# EAGLE design tracer-main (EAGLE 9.6.2)
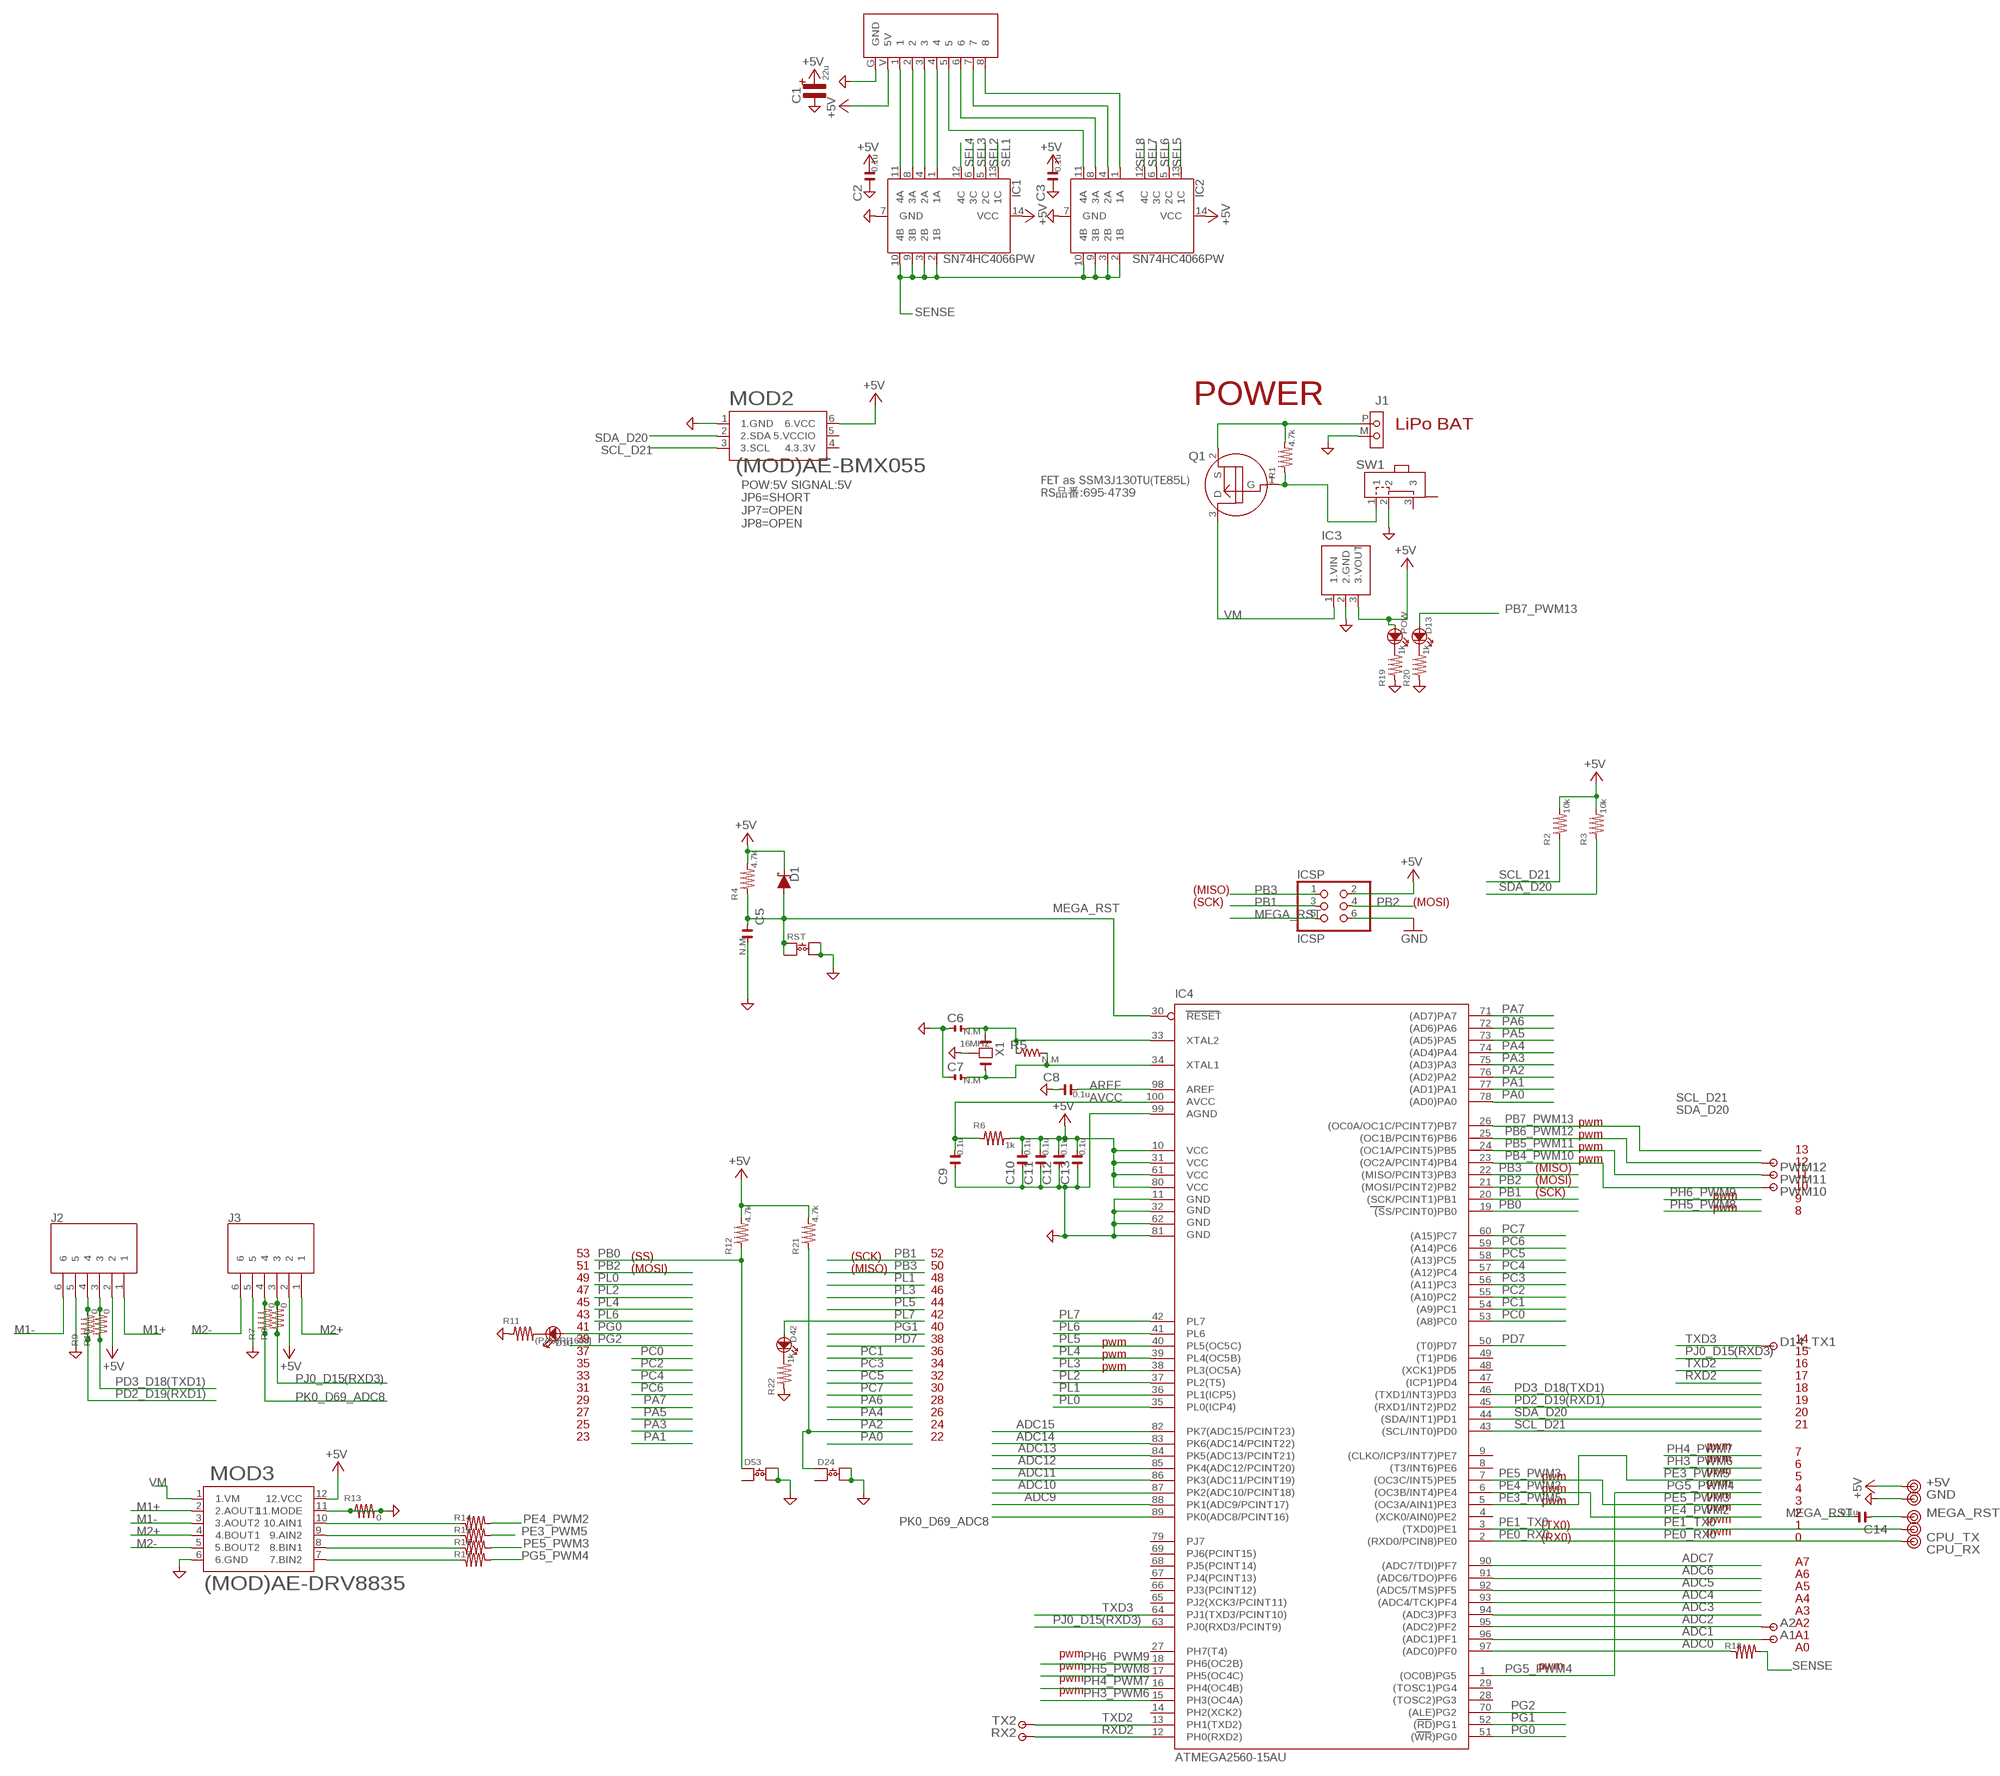
[diagram p0: schematic, sheet 1]

## Parts
+5V  TP-HOLE  [TP-HOLE]
A1  TP  [TP-SQUARE]
A2  TP  [TP-SQUARE]
C1  22u  (PAS)C[3216]  [3216]
C2  0.1u  (PAS)C[1608]  [1608NEW]
C3  0.1u  (PAS)C[1608]  [1608NEW]
C5  N.M  (PAS)C[1608]  [1608NEW]
C6  N.M  C(1005)  [1005]
C7  N.M  C(1005)  [1005]
C8  0.1u  (PAS)C[1608]  [1608NEW]
C9  0.1u  (PAS)C[1608]  [1608NEW]
C10  0.1u  (PAS)C[1608]  [1608NEW]
C11  0.1u  (PAS)C[1608]  [1608NEW]
C12  0.1u  (PAS)C[1608]  [1608NEW]
C13  0.1u  (PAS)C[1608]  [1608NEW]
C14  0.1u  (PAS)C[1608]  [1608NEW]
CPU_RX  TP-HOLE  [TP-HOLE]
CPU_TX  TP-HOLE  [TP-HOLE]
D1  1A/23V/620mV  DIODE-SCHOTTKY-BAT20J  [SOD-323]
D10  (PAS)LED[1608]  [1608LED]
D13  (PAS)LED[1608]  [1608LED]
D14_TX1  TP  [TP-SQUARE]
D24  (SW)USER_SW(AKIDUKI)  [SKRPACE010-PAC]
D42  (PAS)LED[1608]  [1608LED]
D53  (SW)USER_SW(AKIDUKI)  [SKRPACE010-PAC]
GND  TP-HOLE  [TP-HOLE]
IC1  SN74HC4066PW  [SOP65P640X120-14N]
IC2  SN74HC4066PW  [SOP65P640X120-14N]
IC3  (3.3V)VX07803-500  [VX07803-PAC]
IC4  ATMEGA2560-15AU  0023_ATMEGA2560-16AU  [TQFP100]
ICSP  ICSP  0114_PH254-203DF118A00V  [2X03]
J1  B2B-PH  [B2B-PH-PAC]
J2  B6B-ZR-3.4_LF__SN_  [B6BZR34LFSN]
J3  B6B-ZR-3.4_LF__SN_  [B6BZR34LFSN]
MEGA_RST  TP-HOLE  [TP-HOLE]
MOD1  (MOD)LINE-TRACER  [8CH-LINETRACER-MOD]
MOD2  (MOD)AE-BMX055  [MOD-BMX055]
MOD3  (MOD)AE-DRV8835  [AE-DRV8835]
POW  (PAS)LED[1608]  [1608LED]
PWM10  TP  [TP-SQUARE]
PWM11  TP  [TP-SQUARE]
PWM12  TP  [TP-SQUARE]
Q1  FET-PCH(SSM3J130TU)  [SOT65P210X75-3N]
R1  4.7k  (PAS)R[1608]  [1608NEW]
R2  10k  (PAS)R[1608]  [1608NEW]
R3  10k  (PAS)R[1608]  [1608NEW]
R4  4.7k  (PAS)R[1608]  [1608NEW]
R5  N.M  R(1005)  [1005]
R6  1k  (PAS)R[1608]  [1608NEW]
R7  0  (PAS)R[1608]  [1608NEW]
R8  0  (PAS)R[1608]  [1608NEW]
R9  0  (PAS)R[1608]  [1608NEW]
R10  0  (PAS)R[1608]  [1608NEW]
R11  (PAS)R[1608]  [1608NEW]
R12  4.7k  (PAS)R[1608]  [1608NEW]
R13  0  (PAS)R[1608]  [1608NEW]
R14  30  (PAS)R[1608]  [1608NEW]
R15  30  (PAS)R[1608]  [1608NEW]
R16  30  (PAS)R[1608]  [1608NEW]
R17  30  (PAS)R[1608]  [1608NEW]
R18  30  (PAS)R[1608]  [1608NEW]
R19  1k  (PAS)R[1608]  [1608NEW]
R20  1k  (PAS)R[1608]  [1608NEW]
R21  4.7k  (PAS)R[1608]  [1608NEW]
R22  1k  (PAS)R[1608]  [1608NEW]
RST  (SW)USER_SW(AKIDUKI)  [SKRPACE010-PAC]
RX2  TP  [TP-SQUARE]
SW1  MSK12C01  [MSK12C01]
TX2  TP  [TP-SQUARE]
X1  16MHZ  (RESONATOR)CSTCE_10_12_16_20MHZ  [AWSCR8]

## Nets
+5V: +5V.1 C1.1(P) C2.2 C3.2 C10.2 C11.2 C12.2 C13.2 D1.C IC1.14(VCC) IC2.14(VCC) IC3.3(3.VOUT) IC4.10(VCC) IC4.31(VCC1) IC4.61(VCC2) IC4.80(VCC3) ICSP.2 J2.2 J3.2 MOD1.V(5V) MOD2.6(6.VCC) MOD3.12(12.VCC) POW.1(+) R2.2 R3.2 R4.2 R6.2 R12.2 R21.2
ADC0: IC4.97((ADC0)PF0) R18.1
ADC1: A1.1 IC4.96((ADC1)PF1)
ADC2: A2.1 IC4.95((ADC2)PF2)
ADC3: IC4.94((ADC3)PF3)
ADC4: IC4.93((ADC4/TCK)PF4)
ADC5: IC4.92((ADC5/TMS)PF5)
ADC6: IC4.91((ADC6/TDO)PF6)
ADC7: IC4.90((ADC7/TDI)PF7)
ADC9: IC4.88(PK1(ADC9/PCINT17))
ADC10: IC4.87(PK2(ADC10/PCINT18))
ADC11: IC4.86(PK3(ADC11/PCINT19))
ADC12: IC4.85(PK4(ADC12/PCINT20))
ADC13: IC4.84(PK5(ADC13/PCINT21))
ADC14: IC4.83(PK6(ADC14/PCINT22))
ADC15: IC4.82(PK7(ADC15/PCINT23))
AREF: C8.2 IC4.98(AREF)
AVCC: C9.2 IC4.100(AVCC) R6.1
GND: C1.2(M) C2.1 C3.1 C5.2 C6.1 C7.1 C8.1 C9.1 C10.1 C11.1 C12.1 C13.1 D24.2 D24.4 D53.2 D53.4 GND.1 IC1.7(GND) IC2.7(GND) IC3.2(2.GND) IC4.11(GND) IC4.32(GND1) IC4.62(GND2) IC4.81(GND3) IC4.99(AGND) ICSP.6 J1.M J2.5 J3.5 MOD1.G(GND) MOD2.1(1.GND) MOD3.6(6.GND) MOD3.11(11.MODE) R11.1 R13.1 R13.2 R19.1 R20.1 R22.1 RST.2 RST.4 SW1.2 X1.2
M1+: J2.1 MOD3.2(2.AOUT1)
M1-: J2.6 MOD3.3(3.AOUT2)
M2+: J3.1 MOD3.4(4.BOUT1)
M2-: J3.6 MOD3.5(5.BOUT2)
MEGA_RST: C5.1 C14.2 D1.A IC4.30(RESET) ICSP.5 R4.1 RST.1 RST.3
N$1: IC1.11(4A) MOD1.1
N$2: IC1.8(3A) MOD1.2
N$3: IC1.4(2A) MOD1.3
N$4: IC1.1(1A) MOD1.4
N$5: IC2.11(4A) MOD1.5
N$6: IC2.8(3A) MOD1.6
N$7: IC2.4(2A) MOD1.7
N$8: IC2.1(1A) MOD1.8
N$9: J1.P Q1.2(S) R1.2
N$10: Q1.1(G) R1.1 SW1.1
N$11: C14.1 MEGA_RST.1
N$12: MOD3.10(10.AIN1) R14.1
N$13: C6.2 IC4.33(XTAL2) R5.1 X1.1
N$14: C7.2 IC4.34(XTAL1) R5.2 X1.3
N$15: MOD3.9(9.AIN2) R15.1
N$16: MOD3.8(8.BIN1) R16.1
N$17: MOD3.7(7.BIN2) R17.1
N$18: POW.2(-) R19.2
N$19: D13.2(-) R20.2
N$20: D42.2(-) R22.2
N$24: D10.2(-) R11.2
PA0: IC4.78((AD0)PA0)
PA1: IC4.77((AD1)PA1)
PA2: D24.1 IC4.76((AD2)PA2) R21.1
PA3: IC4.75((AD3)PA3)
PA4: IC4.74((AD4)PA4)
PA5: IC4.73((AD5)PA5)
PA6: IC4.72((AD6)PA6)
PA7: IC4.71((AD7)PA7)
PB0: D53.1 IC4.19((SS/PCINT0)PB0) R12.1
PB1: IC4.20((SCK/PCINT1)PB1) ICSP.3
PB2: IC4.21((MOSI/PCINT2)PB2) ICSP.4
PB3: IC4.22((MISO/PCINT3)PB3) ICSP.1
PB4_PWM10: IC4.23((OC2A/PCINT4)PB4) PWM10.1
PB5_PWM11: IC4.24((OC1A/PCINT5)PB5) PWM11.1
PB6_PWM12: IC4.25((OC1B/PCINT6)PB6) PWM12.1
PB7_PWM13: D13.1(+) IC4.26((OC0A/OC1C/PCINT7)PB7)
PC0: IC4.53((A8)PC0)
PC1: IC4.54((A9)PC1)
PC2: IC4.55((A10)PC2)
PC3: IC4.56((A11)PC3)
PC4: IC4.57((A12)PC4)
PC5: IC4.58((A13)PC5)
PC6: IC4.59((A14)PC6)
PC7: IC4.60((A15)PC7)
PD2_D19(RXD1): IC4.45((RXD1/INT2)PD2) J2.4 R9.1 R9.2
PD3_D18(TXD1): IC4.46((TXD1/INT3)PD3) J2.3 R10.1 R10.2
PD7: IC4.50((T0)PD7)
PE0_RX0: CPU_RX.1 IC4.2((RXD0/PCIN8)PE0)
PE1_TX0: CPU_TX.1 IC4.3((TXD0)PE1)
PE3_PWM5: IC4.5((OC3A/AIN1)PE3) R15.2
PE4_PWM2: IC4.6((OC3B/INT4)PE4) R14.2
PE5_PWM3: IC4.7((OC3C/INT5)PE5) R16.2
PG0: D10.1(+) IC4.51((WR)PG0)
PG1: IC4.52((RD)PG1)
PG2: IC4.70((ALE)PG2)
PG5_PWM4: IC4.1((OC0B)PG5) R17.2
PH3_PWM6: IC4.15(PH3(OC4A))
PH4_PWM7: IC4.16(PH4(OC4B))
PH5_PWM8: IC4.17(PH5(OC4C))
PH6_PWM9: IC4.18(PH6(OC2B))
PJ0_D15(RXD3): IC4.63(PJ0(RXD3/PCINT9)) J3.3 R8.1 R8.2
PK0_D69_ADC8: IC4.89(PK0(ADC8/PCINT16)) J3.4 R7.1 R7.2
PL0: IC4.35(PL0(ICP4))
PL1: IC4.36(PL1(ICP5))
PL2: IC4.37(PL2(T5))
PL3: IC4.38(PL3(OC5A))
PL4: IC4.39(PL4(OC5B))
PL5: IC4.40(PL5(OC5C))
PL6: IC4.41(PL6)
PL7: D42.1(+) IC4.42(PL7)
RXD2: IC4.12(PH0(RXD2)) RX2.1
SCL_D21: IC4.43((SCL/INT0)PD0) MOD2.3(3.SCL) R2.1
SDA_D20: IC4.44((SDA/INT1)PD1) MOD2.2(2.SDA) R3.1
SEL1: IC1.13(1C)
SEL2: IC1.5(2C)
SEL3: IC1.6(3C)
SEL4: IC1.12(4C)
SEL5: IC2.13(1C)
SEL6: IC2.5(2C)
SEL7: IC2.6(3C)
SEL8: IC2.12(4C)
SENSE: IC1.2(1B) IC1.3(2B) IC1.9(3B) IC1.10(4B) IC2.2(1B) IC2.3(2B) IC2.9(3B) IC2.10(4B) R18.2
TXD2: IC4.13(PH1(TXD2)) TX2.1
TXD3: D14_TX1.1 IC4.64(PJ1(TXD3/PCINT10))
VM: IC3.1(1.VIN) MOD3.1(1.VM) Q1.3(D)
Unconnected: D24.3 D53.3 IC4.4((XCK0/AIN0)PE2) IC4.8((T3/INT6)PE6) IC4.9((CLKO/ICP3/INT7)PE7) IC4.14(PH2(XCK2)) IC4.27(PH7(T4)) IC4.28((TOSC2)PG3) IC4.29((TOSC1)PG4) IC4.47((ICP1)PD4) IC4.48((XCK1)PD5) IC4.49((T1)PD6) IC4.65(PJ2(XCK3/PCINT11)) IC4.66(PJ3(PCINT12)) IC4.67(PJ4(PCINT13)) IC4.68(PJ5(PCINT14)) IC4.69(PJ6(PCINT15)) IC4.79(PJ7) MOD2.4(4.3.3V) MOD2.5(5.VCCIO) SW1.3 SW1.4

## Notes on the sheet
- POWER
- LiPo BAT
- FET as SSM3J130TU(TE85L)
  RS品番:695-4739
- POW:5V SIGNAL:5V
  JP6=SHORT
  JP7=OPEN
  JP8=OPEN
- (MISO)
- (SCK) | (MOSI)
- pwm
- pwm
- pwm | 13
- pwm | 12
- (MISO)
- 11
- (MOSI)
- 10
- (SCK) | pwm
- 9
- pwm | 8
- 53 | (SS) | (SCK) | 52
- 51 | (MOSI) | (MISO) | 50
- 49 | 48
- 47 | 46
- 45 | 44
- 43 | 42
- 41 | 40
- 39 | 38 | pwm | 14
- 37 | 36 | pwm | 15
- 35 | 34 | pwm | 16
- 33 | 32 | 17
- 31 | 30 | 18
- 29 | 28 | 19
- 27 | 26 | 20
- 25 | 24 | 21
- 23 | 22
- pwm
- 7
- pwm
- 6
- pwm
- pwm | 5
- pwm
- pwm | 4
- pwm
- pwm | 3
- pwm
- 2
- pwm
- (TX0) | 1
- pwm
- (RX0) | 0
- A7
- A6
- A5
- A4
- A3
- A2
- A1
- A0
- pwm
- pwm | pwm
- pwm
- pwm

## Library data of the parts
+5V CPU_RX CPU_TX GND MEGA_RST = myEagleParts8:TP-HOLE
A1 A2 D14_TX1 PWM10-PWM12 RX2 TX2 = myEagleParts8:TP
C1 = myEagleParts8:(PAS)C[3216]
C2 C3 C5 C8-C14 = myEagleParts8:(PAS)C[1608]
C6 C7 = myEagleParts8:C(1005)
D1 = SparkFun-DiscreteSemi:DIODE-SCHOTTKY: Schottky diode A Schottky diode is a semiconductor diode which has a low forward voltage drop and a very fast switching action.; PROD_ID: DIO-11623
D10 D13 D42 POW = myEagleParts8:(PAS)LED[1608]
D24 D53 RST = myEagleParts8:(SW)USER_SW(AKIDUKI): http://akizukidenshi.com/catalog/g/gP-06185/
IC1 IC2 = myEagleParts8:SN74HC4066PW: Quadruple Bilateral Analog Switches Source: Datasheet <http://uk.rs-online.com/web/p/products/6622738P>; DESCRIPTION: Quadruple Bilateral Analog Switches; HEIGHT: 1.2mm; MANUFACTURER_NAME: Texas Instruments; MANUFACTURER_PART_NUMBER: SN74HC4066PW; RS_PART_NUMBER: 6622738P; RS_PRICE-STOCK: http://uk.rs-online.com/web/p/products/6622738P
IC3 = myEagleParts8:(3.3V)VX07803-500
IC4 = IntegratedCircuits:0023_ATMEGA2560-16AU: 8-bit Microcontroller with 256K Bytes In-System Programmable Flash - ATMEGA2560-16AU; CASE: TQFP100_14x14; MONTHLY_USAGE: _____; PART_NUMBER: ATMEGA2560-16AU; PRICE: _____; SUPPLIER: _____; TYPE: Circuito_Integrato
ICSP = Connettori:0114_PH254-203DF118A00V: 3x2 M V h 8,5 mm p2,54; MONTHLY_USAGE: _____; PART_NUMBER: PH254-203DF118A00V; PRICE: _____; SUPPLIER: _____; TYPE: Connettori
J1 = anikimm:B2B-PH
J2 J3 = myEagleParts8:B6B-ZR-3.4_LF__SN_: CONN HEADER VERT 6POS 1.5MM Source: Datasheet <http://www.jst-mfg.com/product/pdf/eng/eZH.pdf>; DESCRIPTION: CONN HEADER VERT 6POS 1.5MM; HEIGHT: 4.5mm; MANUFACTURER_NAME: JST (JAPAN SOLDERLESS TERMINALS); MANUFACTURER_PART_NUMBER: B6B-ZR-3.4(LF)(SN)
MOD1 = myEagleParts8:(MOD)LINE-TRACER
MOD2 = myEagleParts8:(MOD)AE-BMX055
MOD3 = myEagleParts8:(MOD)AE-DRV8835
Q1 = myEagleParts8:FET-PCH(SSM3J130TU): MOSFET Pch 20V 4.4A 0.0258ohm/4.5V UFM Toshiba SSM3J130TU(TE85L) P-channel MOSFET Transistor, 4.4 A, 20 V, 3-Pin UFM Source: Datasheet <http://uk.rs-online.com/web/p/products/6954739>; DESCRIPTION: MOSFET Pch 20V 4.4A 0.0258ohm/4.5V UFM Toshiba SSM3J130TU(TE85L) P-channel MOSFET Transistor, 4.4 A, 20 V, 3-Pin UFM; HEIGHT: 0.75mm; MANUFACTURER_NAME: Toshiba; MANUFACTURER_PART_NUMBER: SSM3J130TU(TE85L); RS_PART_NUMBER: 6954739; RS_PRICE-STOCK: http://uk.rs-online.com/web/p/products/6954739
R1-R4 R6-R22 = myEagleParts8:(PAS)R[1608]
R5 = myEagleParts8:R(1005)
SW1 = myEagleParts8:MSK12C01
X1 = myEagleParts8:(RESONATOR)CSTCE_10_12_16_20MHZ

## Net classes
0 default: width 0.203 mm, drill 0.152 mm, clearance 0.203 mm

## Board
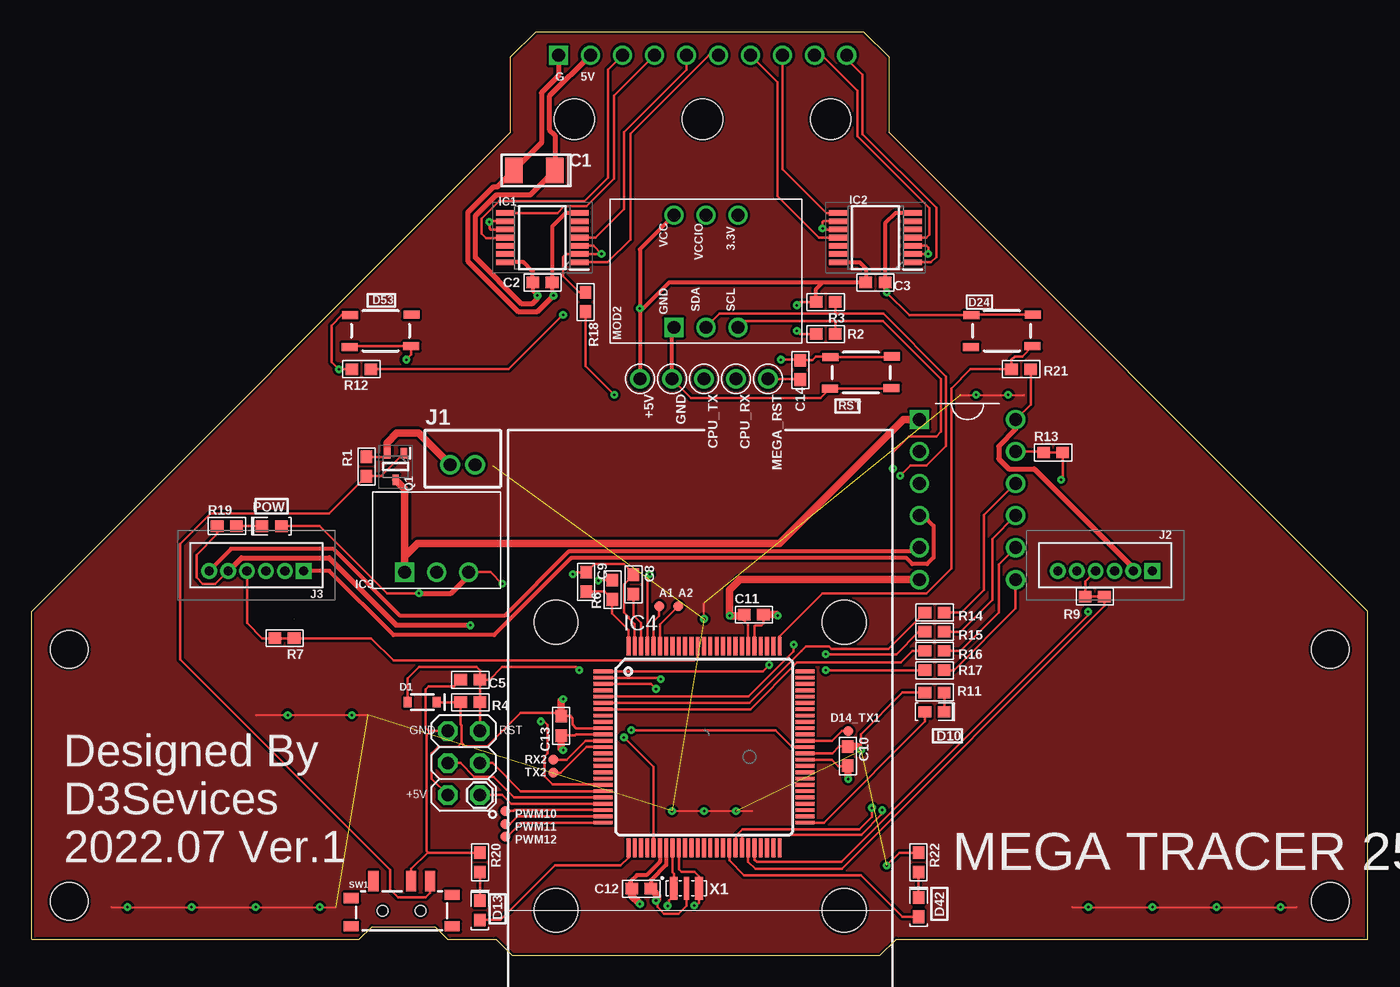
[diagram p1: board, top side]
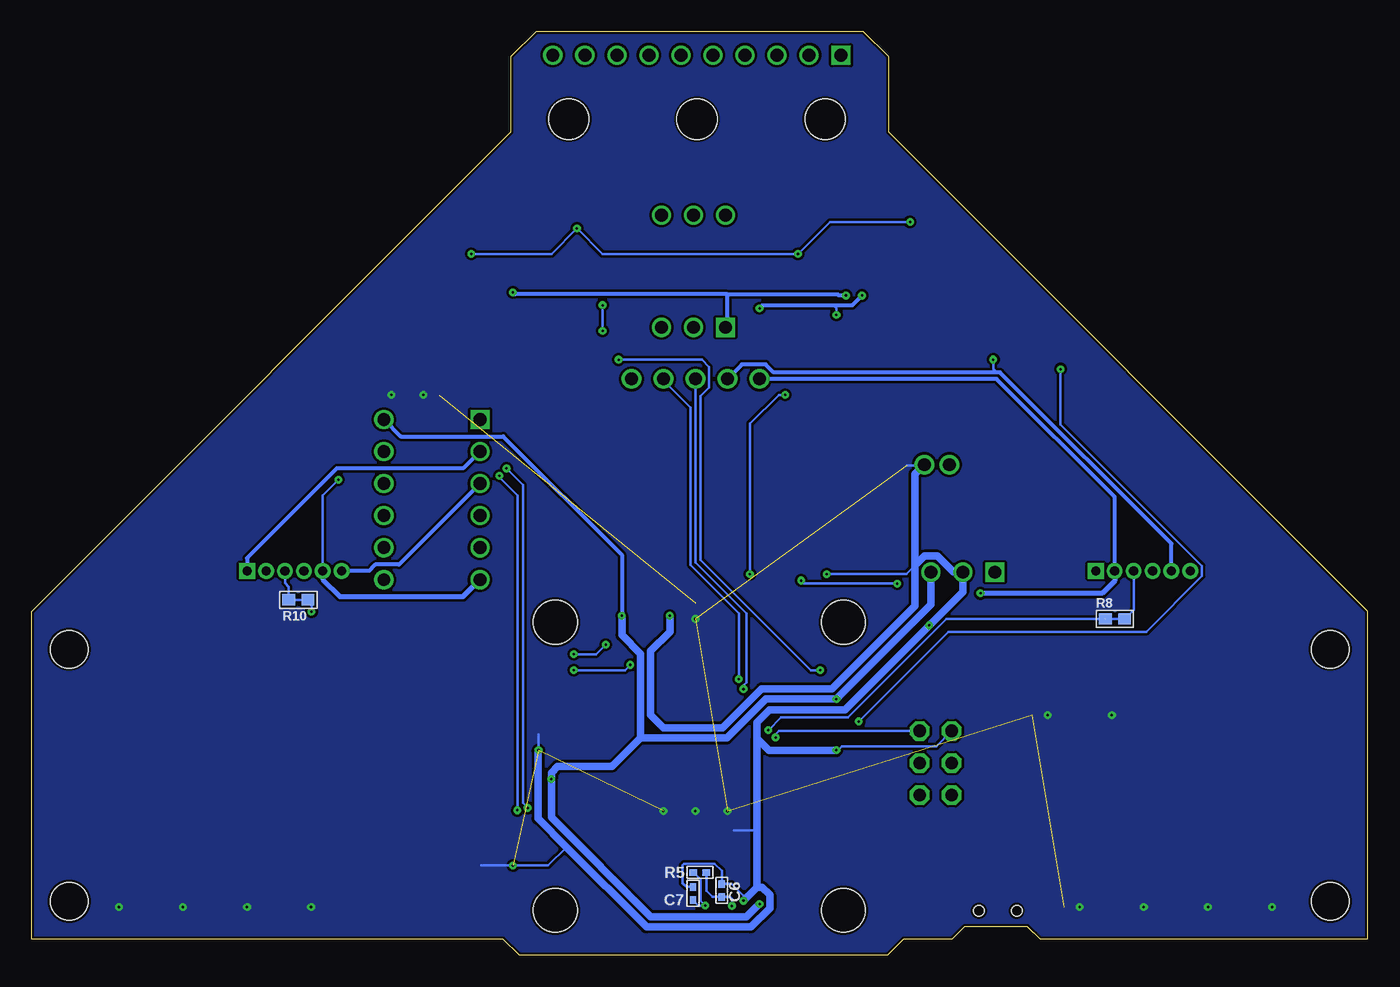
[diagram p2: board, bottom side, seen from below]

Size 106 x 73.27 mm. Coordinates in mm from the lower left corner, seen from the top.
Outline: 0,1.27 26,1.27 27,2.27 32,2.27 33,1.27 36.83,1.27 38.1,0 67.31,0 68.58,1.27 106,1.27 106,27.27 68,65.27 68,71.27 66,73.27 40,73.27 38,71.27 38,65.27 0,27.27 0,1.27
Copper layers (1*16): Top 0.035mm / dielectric 1.5mm / Bottom 0.035mm
Design rules "PCBGoGo": minimum track width 6mil, minimum drill 0.2mm, track to track 6mil, track to pad 6mil, pad to pad 6mil, via to via 6mil, smd to smd 6mil, copper to edge 0.2mm, drill to drill 6mil, minimum pad ring 10mil, minimum via ring 8mil, stop-mask expansion 4mil, vias tented up to drill 0mil, thermal gap 10mil
Holes 3.5 mm at 41.6,26.42 41.6,3.56 64.46,26.42 64.46,3.56
Holes 3 mm at 3,4.27 3,24.27 103,24.27 103,4.27

### Footprints (pad centres in the part's own frame; a part is rotated, then mirrored left to right if it is on the bottom)
TP-HOLE = drill 1.016 pad 1.575: 1 0,0
TP-SQUARE = smd 0.8 x 0.8: 1 0,0
3216 = smd 1.4 x 2: 1 -1.496,0; 2 1.75,0
1608NEW = smd 1 x 0.9: 1 -0.766,0; 2 0.766,0
1005 = smd 0.6 x 0.5: 1 -0.508,0; 2 0.519,0
SOD-323 = smd 0.63 x 0.83: A 1.15,0; C -1.15,0
1608LED = smd 1 x 0.9: 1 -0.766,0; 2 0.766,0
SKRPACE010-PAC = smd 1.27 x 0.635: 1 -2.427,1.227; 2 -2.45,-1.277; 3 2.45,1.277; 4 2.427,-1.227
SOP65P640X120-14N = smd 1.475 x 0.45: 1 -2.938,1.95; 2 -2.938,1.3; 3 -2.938,0.65; 4 -2.938,0; 5 -2.938,-0.65; 6 -2.938,-1.3; 7 -2.938,-1.95; 8 2.938,-1.95; 9 2.938,-1.3; 10 2.938,-0.65; 11 2.938,0; 12 2.938,0.65; 13 2.938,1.3; 14 2.938,1.95
VX07803-PAC = drill 1.016 square: 1 0,0 | drill 1.016: 2 2.54,0; 3 5.08,0
TQFP100 = smd 1.5 x 0.3: 1 -8,6; 2 -8,5.5; 3 -8,5; 4 -8,4.5; 5 -8,4; 6 -8,3.5; 7 -8,3; 8 -8,2.5; 9 -8,2; 10 -8,1.5; 11 -8,1; 12 -8,0.5; 13 -8,0; 14 -8,-0.5; 15 -8,-1; 16 -8,-1.5; 17 -8,-2; 18 -8,-2.5; 19 -8,-3; 20 -8,-3.5; 21 -8,-4; 22 -8,-4.5; 23 -8,-5; 24 -8,-5.5; 25 -8,-6; 51 8,-6; 52 8,-5.5; 53 8,-5; 54 8,-4.5; 55 8,-4; 56 8,-3.5; 57 8,-3; 58 8,-2.5; 59 8,-2; 60 8,-1.5; 61 8,-1; 62 8,-0.5; 63 8,0; 64 8,0.5; 65 8,1; 66 8,1.5; 67 8,2; 68 8,2.5; 69 8,3; 70 8,3.5; 71 8,4; 72 8,4.5; 73 8,5; 74 8,5.5; 75 8,6 | smd 0.3 x 1.5: 26 -6,-8; 27 -5.5,-8; 28 -5,-8; 29 -4.5,-8; 30 -4,-8; 31 -3.5,-8; 32 -3,-8; 33 -2.5,-8; 34 -2,-8; 35 -1.5,-8; 36 -1,-8; 37 -0.5,-8; 38 0,-8; 39 0.5,-8; 40 1,-8; 41 1.5,-8; 42 2,-8; 43 2.5,-8; 44 3,-8; 45 3.5,-8; 46 4,-8; 47 4.5,-8; 48 5,-8; 49 5.5,-8; 50 6,-8; 76 6,8; 77 5.5,8; 78 5,8; 79 4.5,8; 80 4,8; 81 3.5,8; 82 3,8; 83 2.5,8; 84 2,8; 85 1.5,8; 86 1,8; 87 0.5,8; 88 0,8; 89 -0.5,8; 90 -1,8; 91 -1.5,8; 92 -2,8; 93 -2.5,8; 94 -3,8; 95 -3.5,8; 96 -4,8; 97 -4.5,8; 98 -5,8; 99 -5.5,8; 100 -6,8
2X03 = drill 1.016 pad 1.55 octagon: 1 -2.54,-1.27; 2 -2.54,1.27; 3 0,-1.27; 4 0,1.27; 5 2.54,-1.27; 6 2.54,1.27
B2B-PH-PAC = drill 1.016 pad 1.575: M 2,0; P 0,0
B6BZR34LFSN = drill 0.73 pad 1.251 square: 1 0,0 | drill 0.73 pad 1.251: 2 -1.5,0; 3 -3,0; 4 -4.5,0; 5 -6,0; 6 -7.5,0
8CH-LINETRACER-MOD = drill 1.016: 1 -6.35,0; 2 -3.81,0; 3 -1.27,0; 4 1.27,0; 5 3.81,0; 6 6.35,0; 7 8.89,0; 8 11.43,0; V -8.89,0 | drill 1.016 square: G -11.43,0 | hole 3.2: 0,-5.08; -10.16,-5.08; 10.16,-5.08
MOD-BMX055 = drill 1.016 square: 1 0,0 | drill 1.016: 2 0,-2.54; 3 0,-5.08; 4 8.89,-5.08; 5 8.89,-2.54; 6 8.89,0
AE-DRV8835 = drill 1.016 square: 1 0,0 | drill 1.016: 2 0,-2.54; 3 0,-5.08; 4 0,-7.62; 5 0,-10.16; 6 0,-12.7; 7 7.62,-12.7; 8 7.62,-10.16; 9 7.62,-7.62; 10 7.62,-5.08; 11 7.62,-2.54; 12 7.62,0
SOT65P210X75-3N = smd 0.85 x 0.5: 1 -1.05,0.65; 2 -1.05,-0.65; 3 1.05,0
MSK12C01 = smd 0.8 x 1.6: 1 2.25,2.35; 2 0.75,2.35; 3 -2.25,2.35 | smd 1.2 x 0.8: 4 4,-1.25; P$1 -4,1; P$2 -4,-1.25; P$3 4,1.25 | hole 0.85: -1.5,0; 1.5,0
AWSCR8 = smd 0.6 x 1.8: 1 -1,0; 3 1,0 | smd 0.4 x 1.8: 2 0,0

### Placement (x,y rotation side)
+5V  48.26,45.72 90 top
A1  49.78,27.69 0 top
A2  51.31,27.69 0 top
C1  40.01,62.25 180 top
C2  40.52,53.36 180 top
C3  66.94,53.36 180 top
C5  34.8,21.84 180 top
C6  51.25,5.13 270 bottom
C7  53.54,4.9 270 bottom
C8  47.74,29.41 270 top
C9  43.99,29.6 270 top
C10  64.74,15.79 270 top
C11  57.29,27.01 0 top
C12  48.36,5.28 180 top
C13  42.01,18.2 90 top
C14  60.97,46.42 90 top
CPU_RX  55.88,45.72 90 top
CPU_TX  53.34,45.72 90 top
D1  30.99,20.07 180 top
D10  71.63,19.3 0 top
D13  35.56,3.56 90 top
D14_TX1  64.77,17.78 0 top
D24  76.96,49.53 180 top
D42  70.36,3.81 90 top
D53  27.69,49.53 0 top
GND  50.8,45.72 90 top
IC1  40.52,56.92 180 top
IC2  66.94,56.92 180 top
IC3  29.59,30.38 0 top
IC4  53.34,16.51 0 top
ICSP  34.29,15.24 90 top
J1  33.19,38.9 0 top
J2  88.9,30.48 0 top
J3  21.59,30.48 0 top
MEGA_RST  58.42,45.72 90 top
MOD1  53.22,71.4 0 top
MOD2  50.96,49.81 90 top
MOD3  70.43,42.49 0 top
POW  19.05,34.04 180 top
PWM10  37.59,11.43 0 top
PWM11  37.59,10.41 0 top
PWM12  37.59,9.4 0 top
Q1  28.87,38.76 270 top
R1  26.57,38.76 90 top
R2  62.99,49.28 180 top
R3  62.99,51.82 180 top
R4  34.8,20.07 180 top
R5  52.99,6.56 180 bottom
R6  46.07,28.99 90 top
R7  20.07,25.15 180 top
R8  20.07,26.67 0 bottom
R9  84.33,28.45 180 top
R10  84.84,28.19 0 bottom
R11  71.63,20.83 0 top
R12  26.16,46.48 0 top
R13  81.03,39.88 0 top
R14  71.63,27.18 180 top
R15  71.63,25.65 180 top
R16  71.63,24.13 180 top
R17  71.63,22.61 180 top
R18  43.94,51.82 90 top
R19  15.49,34.04 0 top
R20  35.56,7.37 270 top
R21  78.49,46.48 0 top
R22  70.36,7.37 270 top
RST  65.79,46.23 0 top
RX2  41.4,15.49 0 top
SW1  29.36,3.53 0 top
TX2  41.4,14.48 0 top
X1  51.94,5.31 0 top

### Tracks (layer width: path | path; a pad name or v marks a point on that pad's centre or on a via)
+5V  (via drill 0.2 pad 0.3)
  Top 0.203: IC4.10 43.2,18.01 42.93,18.29 42.93,18.8 42.76,18.96 C13.2 41.75,19.22 38.77,19.22 36.13,16.57 34.35,16.57 34.1,16.83 | IC4.61 63.48,15.51 64.01,14.99 64.7,14.99 C10.2 | IC4.80 57.34,26.1 57.4,26.16 57.91,26.16 58.06,26.31 C11.2 | POW.1 22.86,34.04 28.19,28.7 v30.73,28.7 | D1.C R4.2 34.03,18.29 34.1,18.23 34.1,16.83 | 34.1,16.83 33.78,16.51 32.26,16.51 31.75,16 31.75,13.97 ICSP.2 | R6.2 44.99,29.75 v44.96,29.72 | v37.34,29.46 36.42,30.38 IC3.3 | R3.2 60.96,51.82 v60.71,51.56 | R2.2 60.96,49.28 v60.71,49.53 | v42.16,50.8 37.85,46.48 R12.2 | R21.2 79.25,43.69 MOD3.12
  Top 0.305: 48.26,51.05 v48.26,51.31 48.26,56 MOD2.6 | IC1.14 39.01,54.97 39.75,54.23 C2.2 39.75,52.7 v40.13,52.32 | IC2.14 65.68,54.97 66.17,54.48 C3.2 62.74,53.36 | 62.74,53.36 50.57,53.36 48.26,51.05 | 48.26,51.05 +5V.1 | R3.2 62.23,52.85 62.74,53.36 | IC4.31 49.84,7.42 48.77,6.35 48.01,6.35 47.5,5.84 47.5,5.37 C12.2
  Top 0.406: MOD3.12 78.05,41.73 76.71,40.39 76.71,39.37 77.5,38.58 79.53,38.58 87.4,30.71 J2.2 | v30.73,28.7 33.27,28.7 34.67,30.1 IC3.3 | 44.2,71.26 MOD1.V 41.06,68.12 41.06,65.49 41.51,65.04 C1.1 | C1.1 41.12,61.86 | v40.13,52.32 40.13,52.07 39.75,51.69 38.84,51.69 35.2,55.32 35.2,58.66 36.87,60.33 39.58,60.33 C1.1
  Top 0.61: C12.2 47.59,4.73 v48.26,4.06 | v64.77,13.97 64.77,14.99 C10.2 | C11.2 59.1,27.01 v59.18,26.92 | C13.2 42.01,20.16 v42.16,20.32
  Bottom 0.203: v44.96,29.72 44.73,29.49 37.49,29.49 37.47,29.46 v37.34,29.46 | v60.71,51.56 v60.71,49.53 | v42.16,50.8 42.16,51.31 42.42,51.56
  Bottom 0.305: MOD3.12 76.71,41.15 68.58,41.15 59.18,31.75 v59.18,26.92 | J3.2 20.09,36.35 29.46,45.72 +5V.1 | v40.13,52.32 40.89,51.56 42.42,51.56 48.01,51.56 v48.26,51.31
  Bottom 0.406: J3.2 20.09,29.69 21.08,28.7 v30.73,28.7
  Bottom 0.61: v48.26,4.06 49.28,3.05 56.9,3.05 64.77,10.92 v64.77,13.97 64.77,14.48 64.26,14.99 59.94,14.99 57.7,17.23 | v59.18,26.92 59.18,25.4 57.7,23.92 57.7,17.23 | 57.7,17.23 50.84,17.23 47.75,20.32 v42.16,20.32 34.67,27.81 IC3.3
ADC0  (via drill 0.2 pad 0.3)
  Top 0.203: IC4.97 48.84,30.04 v49.02,30.23 | R18.1 43.94,46.74 v46.23,44.45
  Bottom 0.203: v49.02,30.23 49.02,42.16 46.74,44.45 v46.23,44.45
ADC1
  Top 0.203: IC4.96 49.34,26.48 49.78,26.92 A1.1
ADC2
  Top 0.203: IC4.95 49.84,26.22 A2.1
AREF
  Top 0.203: IC4.98 48.34,26.34 47.74,26.94 C8.2
AVCC
  Top 0.203: C9.2 45.46,28.83 46.03,28.25 | 46.03,28.25 R6.1 | IC4.100 47.34,25.81 46.03,27.12 46.03,28.25
BETA_L  (via drill 0.2 pad 0.3)  (3 unrouted)
  Bottom 0.203: 67.82,7.11 70.36,7.11 | 48.51,9.91 50.29,9.91 | 36.58,38.86 35.31,38.86 | 65.79,17.53 65.79,16.26
  other vias: 7.62,3.81 99.06,3.81 12.7,3.81 17.78,3.81 22.86,3.81 93.98,3.81 88.9,3.81 83.82,3.81 50.8,11.43 53.34,11.43 55.88,11.43 53.34,26.67 20.32,19.05 25.4,19.05 74.93,44.45 77.47,44.45
  pour Bottom: -5.08,78.74 114.3,78.74 114.3,-1.27 -5.08,-1.27
BETA_TOP  (4 unrouted)
  Top 0.152: 82.55,3.81 100.33,3.81 | 6.35,3.81 24.13,3.81 | 50.8,11.43 57.15,11.43 | 53.34,26.67 53.34,27.94 | 17.78,19.05 26.67,19.05 | 73.66,44.45 78.74,44.45
  pour Top: -2.54,-1.27 -2.54,74.93 90.17,74.93 107.95,74.93 107.95,-1.27
GND  (via drill 0.2 pad 0.3)
  Top 0.203: C12.1 49.27,5.28 | X1.2 51.94,3.94 51.31,3.3 50.16,3.3 49.63,3.83 49.63,4.42 | IC4.11 43.2,17.51 43.12,17.43 C13.1 | IC4.62 63.51,16.01 64.05,16.56 C10.1 | IC4.81 56.84,26.22 56.52,26.53 56.52,26.92 C11.1 | MOD3.11 80.19,39.95 R13.1 R13.2 81.79,37.85 v81.66,37.72 | R19.1 14.73,33.4 13.08,31.75 13.08,29.97 13.59,29.46 14.57,29.46 J3.5 | C5.2 33.52,21.34 31.5,21.34 31.24,21.08 31.24,18.03 31.5,17.78 ICSP.6 31.68,17.78 31.34,17.44 31.34,8.28 31.5,8.13 R20.1 31.4,8.13 30.11,6.84 SW1.2 | IC4.99 47.84,26.26 47.33,26.77 47.33,26.83 46.98,27.18 46.98,29.42 C8.1 47.74,30.29 46.99,31.04 44.67,31.04 C9.1 43.07,30.37 v42.93,30.23 | RST.4 68.16,44.95 RST.2 62.58,44.2 52.32,44.2 GND.1 | R11.1 69.09,20.83 65.79,17.53 v65.79,16.26 | R22.1 68.84,8.13 v67.82,7.11 | D53.2 25.29,48.3 D53.4 30.11,47.64 v29.72,47.24 | D24.2 74.58,50.81 D24.4 69.64,50.76 v67.82,52.58
  Top 0.305: GND.1 50.8,49.65 MOD2.1 | IC1.7 42.36,58.87 41.29,57.8 C2.1 41.29,52.44 v41.4,52.32 | IC2.7 68.52,58.87 67.7,58.05 C3.1 67.7,52.69 v67.82,52.58 | IC4.32 50.34,7.16 49.13,5.95 C12.1
  Top 0.406: J3.5 15.63,30.48 16.66,31.51 23.61,31.51 28.96,26.16 v34.8,26.16 | v41.4,52.32 40.13,51.05 38.61,51.05 34.59,55.07 34.59,58.91 36.62,60.94 36.94,60.94 C1.2 40.45,64.44 40.45,68.4 41.79,69.75 MOD1.G
  Top 0.61: v42.16,16.26 42.01,16.41 C13.1 | C12.1 49.63,4.77 49.63,4.42 v49.53,4.32 | v65.79,16.26 65.49,16.56 C10.1 | 56.52,26.92 v55.37,26.92 55.37,28.96 56.21,29.79 MOD3.6
  Bottom 0.203: v42.16,16.26 42.04,16.26 41.72,16.57 34.23,16.57 ICSP.6 | v42.93,30.23 36.62,30.23 35.94,30.91 | v81.66,37.72 82.9,36.48 J2.5 | v67.82,7.11 65.02,7.11 63.57,8.57 | v29.72,47.24 29.72,46.48 29.46,46.23 | C7.1 54.05,5.4 54.36,5.71 54.36,7.11 54.23,7.24 51.82,7.24 51.25,6.68 C6.1 50.47,5.64 49.53,4.7 v49.53,4.32
  Bottom 0.305: J3.5 15.59,32.64 29.18,46.23 29.46,46.23 47.15,46.23 47.79,46.86 49.66,46.86 GND.1 | v67.82,52.58 67.67,52.43 50.8,52.43 | MOD2.1 50.8,49.97 50.8,52.43 | 50.8,52.43 42.06,52.43 41.96,52.32 v41.4,52.32
  Bottom 0.406: J2.5 82.9,29.81 81.53,28.45 71.77,28.45 MOD3.6
  Bottom 0.61: 48.45,17.21 48.45,18.47 47.45,19.47 41.49,19.47 v34.8,26.16 32.13,28.83 IC3.2 32.87,30.38 34.14,31.65 35.2,31.65 35.94,30.91 | v42.16,16.26 47.5,16.26 48.45,17.21 | v49.53,4.32 48.45,5.4 | 48.45,5.4 48.45,17.21 | 48.45,5.4 48.07,5.4 47.45,4.78 47.45,3.73 48.94,2.23 57.23,2.23 63.57,8.57 65.84,10.84 65.84,16.21 v65.79,16.26 | v55.37,26.92 55.37,25.65 56.88,24.14 56.88,19.05 55.88,18.04 51.18,18.04 48.09,21.13 42.5,21.13 35.94,27.69 35.94,30.91 | 35.94,30.91 35.94,38.15 J1.M
M1+
  Bottom 0.305: MOD3.2 71.77,38.61 81.79,38.61 88.9,31.5 J2.1
M1-
  Bottom 0.305: MOD3.3 76.85,30.99 78.73,30.99 79.24,30.48 J2.6
M2+
  Top 0.305: MOD3.4 70.74,34.87 71.55,34.06 71.55,31.54 71.04,31.03 69.86,31.03 69.4,31.5 42.8,31.5 36.7,25.4 28.7,25.4 23.62,30.48 J3.1
M2-
  Top 0.305: MOD3.5 70.11,32.01 42.59,32.01 37.51,26.92 29.24,26.92 23.94,32.22 15.83,32.22 J3.6
MEGA_RST  (via drill 0.2 pad 0.3)
  Top 0.203: IC4.30 49.34,14.92 v46.99,17.27 | C5.1 R4.1 ICSP.5 | D1.A 29.84,21.96 30.73,22.86 35.31,22.86 35.56,22.6 C5.1 | v43.43,22.61 43.18,22.86 37.34,22.86 36.32,21.84 C5.1 | v59.44,47.24 60.92,47.24 C14.2 61.92,47.19 62.23,47.5 63.32,47.5 RST.1 68.19,47.46 RST.3
  Bottom 0.203: v46.99,17.27 46.99,17.53 46.74,17.78 ICSP.5 | v43.43,22.61 44.2,22.61 52.93,31.34 52.93,44.35 52.25,45.03 52.25,46.66 52.83,47.24 v59.44,47.24
N$1
  Top 0.203: MOD1.1 45.72,70.25 45.72,61.69 43.85,59.82 37.08,59.82 35.71,58.45 35.71,57.25 36.07,56.9 37.56,56.9 IC1.11
N$2
  Top 0.203: MOD1.2 46.2,68.19 46.2,61.6 44.01,59.4 42.24,59.4 41.71,58.87 IC1.8
N$3
  Top 0.203: MOD1.3 51.95,70.25 46.99,65.3 46.99,59.18 44.73,56.92 IC1.4
N$4
  Top 0.203: MOD1.4 53.73,71.4 47.5,65.17 47.5,56.77 45.7,54.97 IC1.1
N$5
  Top 0.203: IC2.11 62.46,56.92 59.16,60.22 59.16,69.26 MOD1.5
N$6
  Top 0.203: MOD1.6 59.57,62.35 63.05,58.87 IC2.8
N$7
  Top 0.203: IC2.4 70.99,56.92 71.22,57.15 71.22,59.27 65.51,64.98 65.51,68.58 62.7,71.4 MOD1.7
N$8
  Top 0.203: MOD1.8 64.65,71.11 65.92,69.84 65.92,65.14 71.75,59.31 71.75,55.37 71.35,54.97 IC2.1
N$9
  Top 0.203: R1.2 27.89,39.53 28.19,39.83
  Top 0.61: J1.P 30.69,41.4 28.96,41.4 28.19,40.64 28.19,39.83 Q1.2
N$10
  Top 0.203: Q1.1 27.71,38 R1.1 23.62,35.05 14.22,35.05 11.79,32.61 11.79,23.45 28.45,6.79 28.45,5.21 29.08,4.57 31.24,4.57 31.61,4.94 SW1.1
N$11
  Top 0.203: MEGA_RST.1 60.91,45.72 C14.1
N$12
  Top 0.203: MOD3.10 75.54,34.9 75.54,28.96 73.76,27.18 R14.1
N$13  (via drill 0.2 pad 0.3)
  Top 0.203: IC4.33 50.84,6.56 50.94,6.46 X1.1 50.94,4.71 50.57,4.35 50.57,4.04 v50.45,3.91
  Bottom 0.203: R5.1 52.48,5.11 51.99,4.62 C6.2 50.59,4.62 50.45,4.47 v50.45,3.91
N$14  (via drill 0.2 pad 0.3)
  Top 0.203: IC4.34 51.34,6.83 51.56,6.6 52.58,6.6 52.94,6.24 X1.3 52.94,4.17 52.7,3.94 v52.55,3.94
  Bottom 0.203: C7.2 53.1,3.94 52.58,3.94 | 52.58,3.94 v52.55,3.94 | R5.2 52.96,6.02 52.96,4.32 52.58,3.94
N$15
  Top 0.203: MOD3.9 76.2,33.02 76.2,28.19 73.66,25.65 R15.1
N$16
  Top 0.203: MOD3.8 78.05,32.32 76.73,30.99 76.73,27.2 73.66,24.13 R16.1
N$17
  Top 0.203: MOD3.7 78.05,27.5 73.15,22.61 R17.1
N$18
  Top 0.203: POW.2 R19.2
N$19
  Top 0.203: D13.2 R20.2
N$20
  Top 0.203: D42.2 R22.2
N$24
  Top 0.203: D10.2 R11.2
PA2
  Top 0.203: IC4.76 59.34,25.3 62.74,28.7 70.98,28.7 72.95,30.67 72.95,44.96 74.47,46.48 R21.1 77.72,47.24 77.98,47.5 78.58,47.5 D24.1
PB0  (via drill 0.2 pad 0.3)
  Top 0.203: IC4.19 45.3,13.55 41.33,13.55 40.7,14.19 40.7,15.79 40.93,16.02 40.93,18.25 40.64,18.54 v40.39,18.54 | D53.1 24.59,50.76 23.79,49.95 23.79,47.05 24.35,46.48 v24.38,46.48 R12.1
  Bottom 0.203: v40.39,18.54 33.27,25.66 17.59,25.66 13.16,30.09 13.16,30.86 24.38,42.09 v24.38,46.48
PB1
  Top 0.203: IC4.20 38.81,13.01 36.58,15.24 ICSP.3
PB2
  Top 0.203: IC4.21 38.29,12.51 36.64,14.16 35.11,14.16 34.03,15.24 ICSP.4
PB3
  Top 0.203: IC4.22 38.03,12.01 37.34,12.7 ICSP.1
PB4_PWM10
  Top 0.203: IC4.23 38.31,11.51 38.23,11.43 PWM10.1
PB5_PWM11
  Top 0.203: IC4.24 38.57,11.01 37.97,10.41 PWM11.1
PB6_PWM12
  Top 0.203: IC4.25 38.83,10.51 37.72,9.4 PWM12.1
PB7_PWM13
  Top 0.203: IC4.26 47.34,7.72 46.74,7.11 41.51,7.11 37.19,2.79 D13.1
PD2_D19(RXD1)
  Top 0.203: IC4.45 56.84,7.42 57.4,6.86 64.26,6.86 85.09,27.69 R9.1 R9.2 83.57,29.65 J2.4
PD3_D18(TXD1)  (via drill 0.2 pad 0.3)
  Top 0.203: IC4.46 57.34,7.58 57.53,7.39 64.22,7.39 83.82,26.99 83.82,27.22 v83.79,27.25
  Bottom 0.203: J2.3 85.9,29.51 85.6,29.21 R10.1 R10.2 83.79,27.91 v83.79,27.25
PE0_RX0  (via drill 0.2 pad 0.3)
  Top 0.203: v49.9,21.9 49.79,22.01 IC4.2
  Bottom 0.203: v49.9,21.9 49.9,27.11 53.75,30.95 53.75,43.43 55.88,45.57 CPU_RX.1
PE1_TX0  (via drill 0.2 pad 0.3)
  Top 0.203: v49.53,21.12 49.14,21.51 IC4.3
  Bottom 0.203: v49.53,21.12 49.53,21.41 49.29,21.65 49.29,27.11 53.34,31.16 CPU_TX.1
PE3_PWM5  (via drill 0.2 pad 0.3)
  Top 0.203: IC4.5 56.86,20.51 60.45,24.1 v60.45,24.64 | R15.2 70.36,25.65 68.58,23.88 v62.99,23.88
  Bottom 0.203: v62.99,23.88 61.21,23.88 v60.45,24.64
PE4_PWM2
  Top 0.203: IC4.6 56.93,20.01 61.07,24.15 61.41,24.49 63.24,24.49 63.45,24.28 67.97,24.28 R14.2
PE5_PWM3
  Top 0.203: IC4.7 57.01,19.51 60.72,23.22 68.94,23.22 69.85,24.13 R16.2
PG0
  Top 0.203: IC4.51 62.83,10.51 70.86,18.54 D10.1
PG5_PWM4  (via drill 0.2 pad 0.3)
  Top 0.203: IC4.1 58.03,22.51 58.53,23.01 v58.51,23.02 | v62.99,22.61 R17.2
  Bottom 0.203: v62.99,22.61 58.93,22.61 v58.51,23.02
PJ0_D15(RXD3)  (via drill 0.2 pad 0.3)  (1 unrouted)
  Top 0.203: IC4.63 60.33,16.51 58.99,17.85 v47.56,17.85
  Bottom 0.203: v47.56,17.85 46.55,18.86 | 46.55,18.86 | R8.1 33.43,26.67 41.23,18.86 46.55,18.86 | R8.1 R8.2 18.59,27.38 J3.3
PK0_D69_ADC8
  Top 0.203: J3.4 17.09,26.34 18.29,25.15 R7.2 R7.1 26.92,25.15 28.7,23.37 52.53,23.37 52.84,23.68 IC4.89
PL7
  Top 0.203: IC4.42 55.34,7.53 56.52,6.35 65.79,6.35 69.09,3.04 D42.1
RXD2
  Top 0.203: IC4.12 43.93,17.01 42.42,15.49 RX2.1
SCL_D21  (via drill 0.2 pad 0.3)
  Top 0.203: IC4.43 55.88,8.55 55.88,9.46 56.4,9.97 65.65,9.97 66.65,10.97 v66.65,11.68 | 63.75,50.32 67.54,50.32 72.14,45.72 72.14,41.53 71.75,41.15 69.6,41.15 68.33,39.88 v68.33,38.61 | 63.75,50.32 62.48,50.32 | 62.48,50.32 56.55,50.32 MOD2.3 | 62.48,50.31 62.48,50.32 | R2.1 63.75,50.32
  Bottom 0.203: v66.65,11.68 67.03,12.06 67.03,37.31 v68.33,38.61
SDA_D20  (via drill 0.2 pad 0.3)
  Top 0.203: IC4.44 56.34,9.34 56.56,9.56 65.82,9.56 67.46,11.21 v67.46,11.49 v67.46,11.5 | MOD2.2 54.56,50.88 62.48,50.88 | 62.48,50.88 63.75,50.88 | 63.75,50.88 67.56,50.88 72.54,45.89 72.54,40.4 70.98,38.84 69.7,38.84 v68.9,38.03 | 62.48,50.88 | R3.1 63.76,50.88 63.75,50.88
  Bottom 0.203: v67.46,11.49 67.46,36.47 68.9,37.91 v68.9,38.03
SENSE  (via drill 0.2 pad 0.3)
  Top 0.203: IC1.3 44.57,56.27 v45.21,55.63 IC1.2 42.42,55.63 42.16,55.37 42.16,53.85 43.43,52.58 R18.2 | IC2.9 62.79,58.22 62.74,58.17 v62.74,57.66 62.83,57.57 IC2.10 | IC2.3 70.98,56.27 71.12,56.13 v71.12,55.63 v71.11,55.62 IC2.2 | IC1.10 36.41,57.57 36.32,57.66 v36.32,58.17 36.38,58.22 IC1.9
  Bottom 0.203: v71.12,55.63 64.77,55.63 v62.74,57.66 60.71,55.63 v45.21,55.63 42.67,58.17 v36.32,58.17
TXD2
  Top 0.203: IC4.13 44.01,16.51 41.98,14.48 TX2.1
TXD3
  Top 0.203: IC4.64 63.49,17.01 64.26,17.78 D14_TX1.1
VM
  Top 0.61: MOD3.1 69.16,42.49 59.34,32.67 30.63,32.67 29.59,31.62 | 29.59,31.62 IC3.1 | Q1.3 29.59,36.99 29.59,31.62

### Text on the board
tPlace: GND | RST | +5V | Designed By / D3Sevices / 2022.07 Ver.1 | MEGA TRACER 256